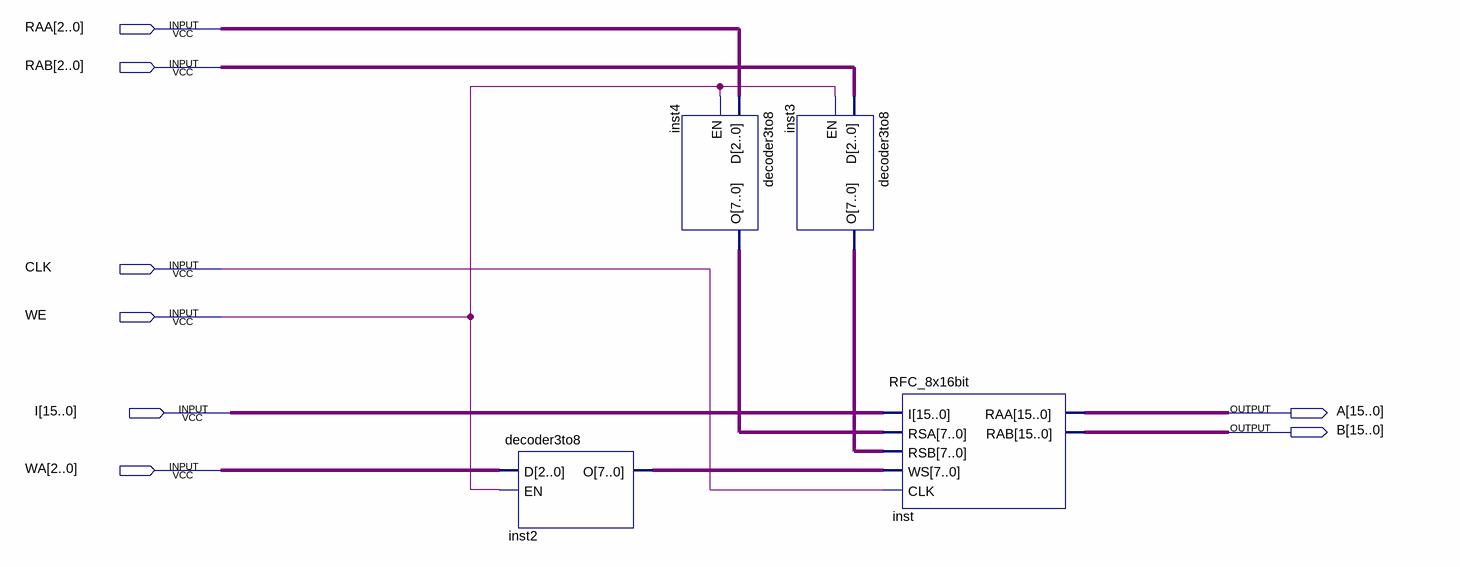
[diagram p0: schematic sheet]
// Quartus schematic RFC.bdf as structural Verilog: 4 symbols, 8 pins
module RFC (
  input  [2:0] RAA,
  input  [2:0] RAB,
  input  CLK,
  input  WE,
  input  [15:0] I,
  input  [2:0] WA,
  output [15:0] A,
  output [15:0] B
);

  wire [7:0] inst2_o, inst3_o, inst4_o;

  decoder3to8 inst2 (.D(WA), .EN(WE), .O(inst2_o));
  decoder3to8 inst4 (.D(RAA), .EN(WE), .O(inst4_o));
  decoder3to8 inst3 (.D(RAB), .EN(WE), .O(inst3_o));
  RFC_8x16bit inst (.I(I), .RSA(inst4_o), .RSB(inst3_o), .WS(inst2_o), .CLK(CLK), .RAA(A), .RAB(B));
endmodule
